# Altium schematic sheet DAQ_Schematic_V1.SchDoc
size A; SheetNumber: 2; SheetTotal: 2
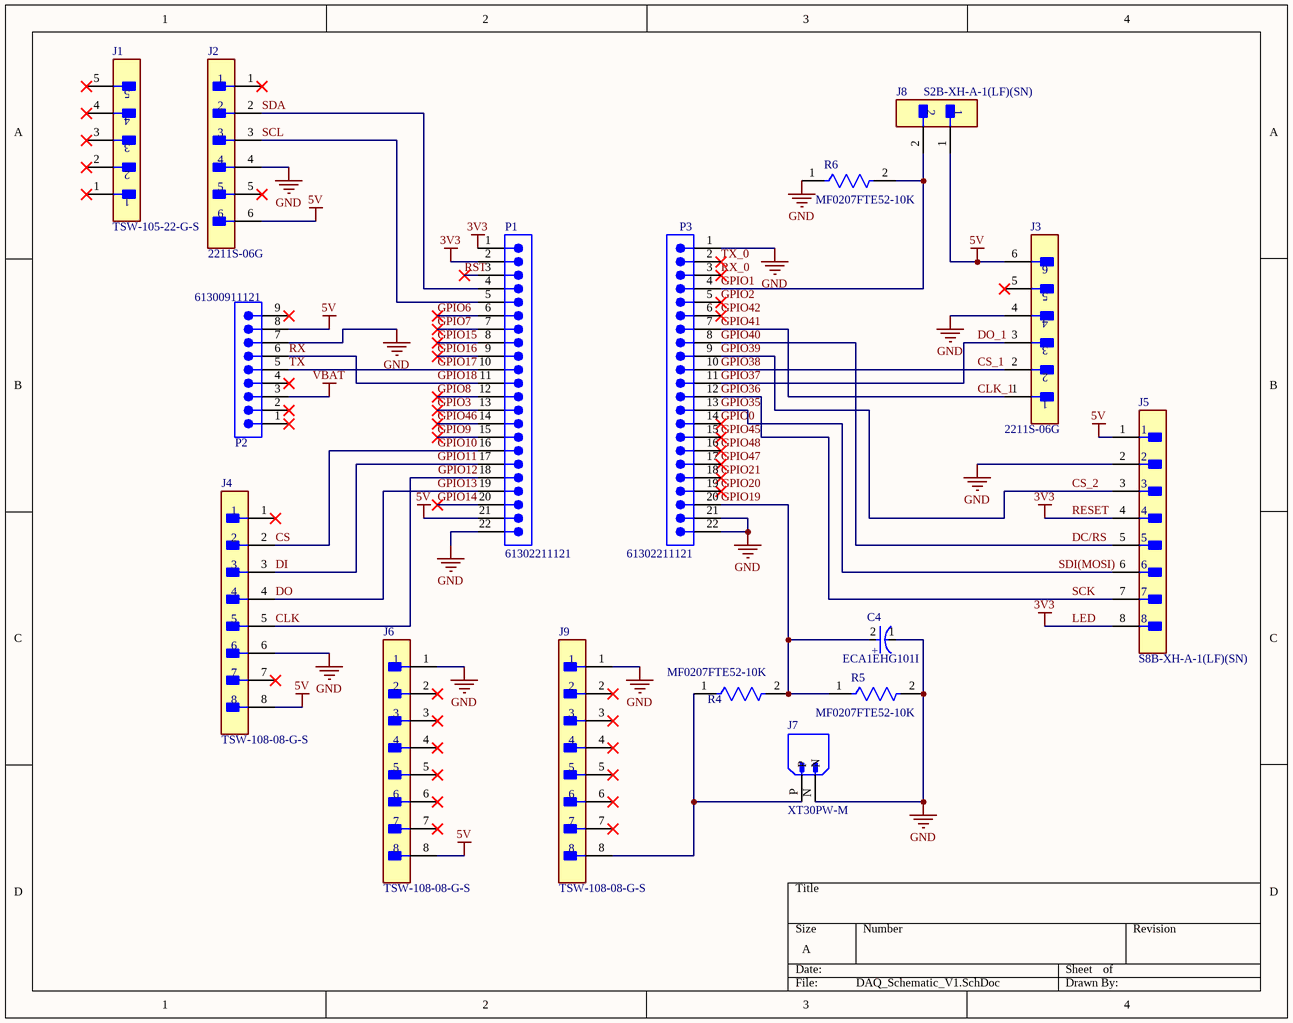
[diagram p0: DAQ_Schematic_V1.SchDoc]

## Parts
C4  ECA1EHG101I  [FP-RAD-TH-D_6_3_0_5-L_11-MFG]
J1  TSW-105-22-G-S  [FP-TSW-105-22-G-S-MFG]
J2  2211S-06G  [FP-2211S-06G-MFG]
J3  2211S-06G  [FP-2211S-06G-MFG]
J4  TSW-108-08-G-S  [FP-TSW-108-08-G-S-MFG]
J5  S8B-XH-A-1(LF)(SN)  [FP-S8B-XH-A-1_LF_SN-MFG]
J6  TSW-108-08-G-S  [FP-TSW-108-08-G-S-MFG]
J7  XT30PW-M  [AMASS_XT30PW-M]
J8  S2B-XH-A-1(LF)(SN)  [FP-S2B-XH-A-1_LF_SN-MFG]
J9  TSW-108-08-G-S  [FP-TSW-108-08-G-S-MFG]
P1  61302211121  [61302211121]
P2  61300911121  [61300911121]
P3  61302211121  [61302211121]
R4  MF0207FTE52-10K  [FP-MF0207-MFG]
R5  MF0207FTE52-10K  [FP-MF0207-MFG]
R6  MF0207FTE52-10K  [FP-MF0207-MFG]

## Nets
5V: J2.6 J3.6 J4.8 J5.1 J6.8 J8.1 P1.21 P2.8
GND: C4.1(C) J2.4 J3.4 J4.6 J5.2 J6.1 J7.N J9.1 P1.22 P2.7 P3.1 P3.21 P3.22 R5.2 R6.1
LED: J5.4 J5.8 P1.1 P1.2  [also labelled 3V3, RESET]
VBAT: P2.3
CLK: J4.5 P1.18  [also labelled GPIO12]
CLK_1: J3.1 P3.7  [also labelled GPIO41]
CS: J4.2 P1.16  [also labelled GPIO10]
CS_1: J3.2 P3.10  [also labelled GPIO38]
CS_2: J5.3 P3.9  [also labelled GPIO39]
DC/RS: J5.5 P3.8  [also labelled GPIO40]
DI: J4.3 P1.17  [also labelled GPIO11]
DO: J4.4 P1.19  [also labelled GPIO13]
DO_1: J3.3 P3.11  [also labelled GPIO37]
GPIO0: P3.14
GPIO1: J8.2 P3.4 R6.2
GPIO2: P3.5
GPIO3: P1.13
GPIO6: P1.6
GPIO7: P1.7
GPIO8: P1.12
GPIO9: P1.15
GPIO14: P1.20
GPIO15: P1.8
GPIO16: P1.9
GPIO17: P1.10 P2.5  [also labelled TX]
GPIO18: P1.11 P2.6  [also labelled RX]
GPIO19: C4.2(A) P3.20 R4.2 R5.1
GPIO20: P3.19
GPIO21: P3.18
GPIO35: J5.6 P3.13  [also labelled SDI(MOSI)]
GPIO36: J5.7 P3.12  [also labelled SCK]
GPIO42: P3.6
GPIO45: P3.15
GPIO46: P1.14
GPIO47: P3.17
GPIO48: P3.16
RST: P1.3
RX_0: P3.3
SCL: J2.3 P1.5
SDA: J2.2 P1.4
TX_0: P3.2
NetJ7_P: J7.P J9.8 R4.1

Not connected (* = marked no-connect by the designer): J1 1* 2* 3* 4* 5*; J2 1* 5*; J3 5*; J4 1* 7*; J6 2* 3* 4* 5* 6* 7*; J9 2* 3* 4* 5* 6* 7*; P2 1* 2* 4* 9*

## Notes on the sheet
- (in symbol CMP-05427-000141-1) +

## Library data of the parts
C4 = CMP-05427-000141-1: Aluminum Electrolytic Capacitors (Radial Lead Type) AEC-Q200 Qualified 100uF ±20% 25V; Lead Diameter: 0.5mm; Life (Hours): 1000Hour; Ripple Current: 130mA; Lead/Base Style: Straight; Construction: RADIAL; Radiation Hardening: No; Packaging: Ammo Pack; Termination: Radial; Mount: Through Hole; Lead Pitch: 2.5mm; Tolerance: 20%; Height - Seated (Max): 0.48inch; Height: 11.2mm; Max Operating Temperature: 105°C; Length: 11.2mm; Diameter: 6.3mm; RoHS Compliant: Yes; Voltage Rating: 25V; Min Operating Temperature: -55°C; Package Quantity: 2000; Capacitance: 100uF; Width: 6.3mm; Voltage Rating (DC): 25V; Series: NHG; Contact Plating: Tin; Case/Package: Radial
J1 = CMP-02766-000105-1: CONN HEADER VERT 5POS 2.54MM; Gender: Male; Number of Contacts: 5; Contact Plating: Gold; Mount: Through Hole; REACH SVHC: No SVHC; Number of Rows: 1; Contact Material: Bronze; Termination: Through Hole
J2 J3 = CMP-12414-000005-1: Board-To-Board Connector, 2.54 mm, 6 Contacts, Header, 2211S Series, Through Hole, 1 Rows; Gender: Male; Number of Contacts: 6; Insulation Resistance: 1GR; Contact Plating: Gold; RoHS Compliant: No; Length: 0.59inch; Weight: 0.11lb; Height: 0.47inch; Number of Rows: 1; Width: 0.12inch; Termination: Through Hole; Flammability Rating: UL94 V-0; REACH SVHC: No SVHC; Contact Material: Copper Alloy; Mount: Through Hole
J4 J6 J9 = CMP-02766-000001-1: CONN HEADER VERT 8POS 2.54MM; Manufacturer: Samtec; Number Of Contacts: 8; Conn Orientation: Straight; Conn Gender: Male; Device Class L1: Connectors; ComponentLink2Description: Datasheet; Digikey Description: CONN HEADER VERT 8POS 2.54MM; ComponentLink2URL: http://suddendocs.samtec.com/catalog_english/tsw_th.pdf; Temperature: -55°C to +125°C; RoHS: TRUE; Mouser Description: TSW - Samtec 2.54mm Pin Header 13.46mm Overall Pin Length 5.08mm Tail; Automotive: No; Temperature Range High: +125°C; Package: TSW-108-08-G-S; Device Class L3: unset; Manufacturer Part Number: TSW-108-08-G-S; Pitch: 2.54mm; Number Of Rows: 1; Lead Free: Yes; Height: 8.71mm; Contact Material: Gold,Nickel; Footprint Url: http://suddendocs.samtec.com/prints/tsw-xxx-xx-x-x-xx-xxx-footprint.pdf; Temperature Range Low: -55°C; Octopart: https://octopart.com/tsw-108-08-g-s-samtec-272653; Category: Conn; Device Class L2: Headers and Wire Housings
J5 = CMP-17439-000621-1: CONN HEADER R/A 8POS 2.5MM; Voltage Rating: 250V; Number of Positions: 8; Flammability Rating: UL94 V-0; Fastening Type: Detent; Series: XH; Connector Type: Header; Min Operating Temperature: -25°C; Lead Free: Lead Free; Number of Rows: 1; Packaging: Bulk; Contact Shape: Square; Contact Type: Male Pin; Mount: Through Hole; Contact Finish - Mating: TIN; Insulation Material: Nylon; Insulation Color: Natural; Contact Material: Brass; Max Operating Temperature: 85°C; Termination: Press-Fit
J7 = CMP-002-00074-1: Socket; DC supply; XT30; male; PIN: 2; on PCBs; THT; Colour: yellow; MF: AMASS; Case/Package: None; Component Type: Standard; Pins: 2; Value: *; Source: XT30PW-M.SchLib; Check_prices: https://www.snapeda.com/parts/XT30PW-M/AMASS/view-part/?ref=eda; MP: XT30PW-M; SnapEDA_Link: https://www.snapeda.com/parts/XT30PW-M/AMASS/view-part/?ref=snap; Design Item ID: XT30PW-M
J8 = CMP-17439-000260-1: CONN HEADER R/A 2POS 2.5MM; Voltage Rating: 250V; Number of Positions: 2; Contact Material: Brass; Series: XH; Contact Finish - Mating: TIN; Max Operating Temperature: 85°C; Number of Rows: 1; Packaging: Bulk; Insulation Color: Natural; Lead Free: Lead Free; Fastening Type: Detent; Termination: Press-Fit; Connector Type: Header; Insulation Material: Nylon; Contact Shape: Square; Contact Type: Male Pin; Mount: Through Hole; Min Operating Temperature: -25°C; Flammability Rating: UL94 V-0
P1 P3 = CMP-1502-01106-4: THT Vertical Pin Header WR-PHD, Pitch 2.54 mm, Single Row, 22 pins; Gender: Male; Pitch: 2.54mm; Operating Supply Voltage: 250V; Current Rating: 3A; Number of Positions: 22; Contact Resistance: 20mΩ; Connector Type: Male Pin; Number of Rows: 1; Orientation: Vertical; Number of Pins: 22; Contact Material: Copper; Contact Mating Length: 5.9944mm; Lead Pitch: 2.54mm; Termination: Solder; Contact Plating: Gold; Color: Black; Number of Contacts: 22; Packaging: Bulk; RoHS: Compliant; Mount: Through Hole
P2 = CMP-1502-01080-4: THT Vertical Pin Header WR-PHD, Pitch 2.54 mm, Single Row, 9 pins; Pitch: 2.54mm; Connector Type: Male Pin; Current Rating: 3A; Number of Positions: 9; Operating Supply Voltage: 250V; Gender: Male; Contact Resistance: 20mΩ; Color: Black; Packaging: Bulk; Number of Pins: 9; Contact Plating: Gold; Contact Material: Copper; RoHS: Compliant; Contact Mating Length: 5.9944mm; Termination: Solder; Lead Pitch: 2.54mm; Orientation: Vertical; Number of Contacts: 9; Number of Rows: 1; Mount: Through Hole
R4-R6 = CMP-03413-000006-1: RES 10K OHM 1% 0.6W AXIAL; Temperature Coefficient: 50ppm/°C; Resistance: 10kR; Mount: Through Hole; Radiation Hardening: No; Tolerance: 1%; Construction: Cylindrical; Contact Plating: Tin; Case/Package: Conformal; Resistor Type: Metal Film; Min Operating Temperature: -55°C; Military Standard: Not; Lead Free: Lead Free; Diameter: 2.4mm; Termination: Axial; Max Operating Temperature: 155°C; RoHS Compliant: Yes; Packaging: Ammo Pack; Length: 6.3mm